# EAGLE design red2 (EAGLE 6.5.0)
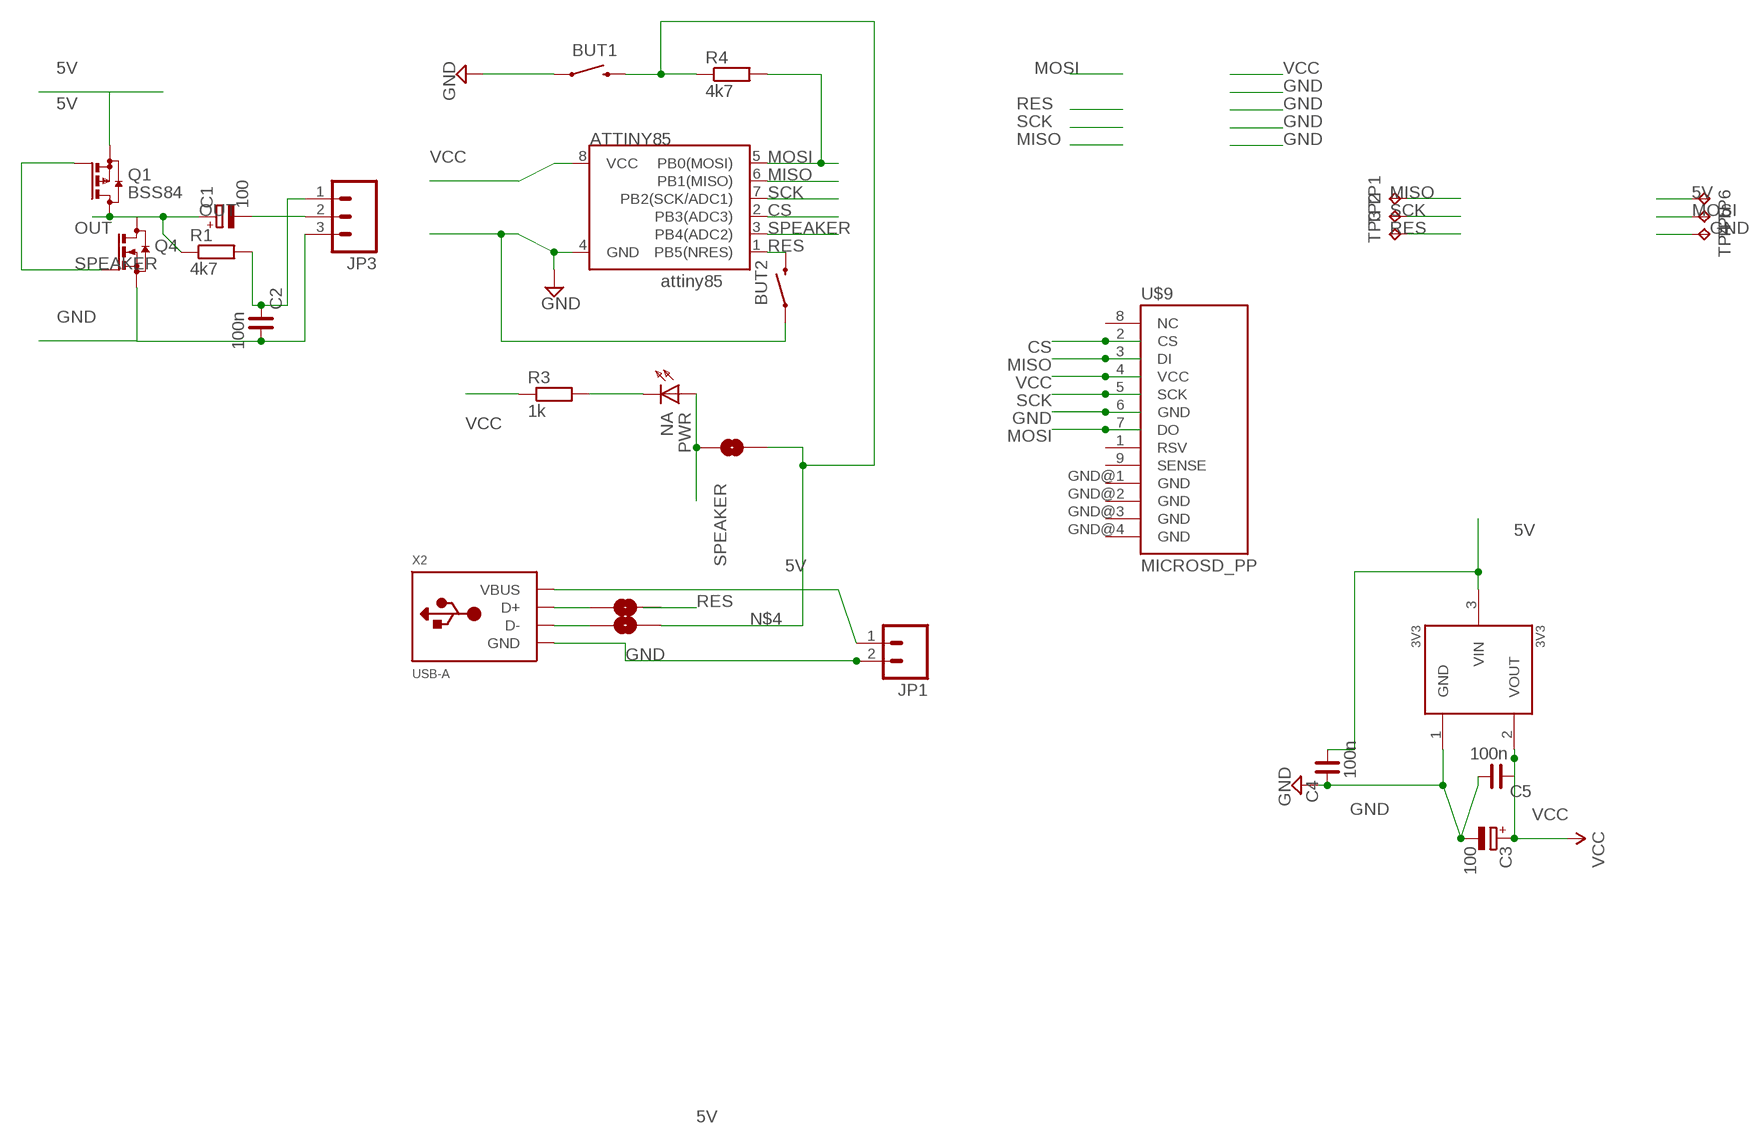
[diagram p0: schematic, sheet 1]

## Parts
3V3  3V3  MCP1700T  [SOT23]
ATTINY85  ATTINY45  [SO08-EIAJ]
BUT1  SWITCH-MOMENTARY-2-SMD-1101NE  [TACTILE-SWITCH-1101NE]
BUT2  SWITCH-MOMENTARY-2-SMD-1101NE  [TACTILE-SWITCH-1101NE]
C1  100  CPOL-EU153CLV-0605  [153CLV-0605]
C2  100n  C_0603  [C0603]
C3  100  CPOL-EU153CLV-0605  [153CLV-0605]
C4  100n  C_0603  [C0603]
C5  100n  C_0603  [C0603]
JP1  M02PTH  [1X02]
JP3  M03PTH  [1X03]
PWR  NA  LED0603DWS  [LED-0603]
Q1  BSS84  [SOT23]
Q4  BSS123  [SOT23]
R1  4k7  R-EU_R0603  [R0603]
R3  1k  R-EU_R0603  [R0603]
R4  4k7  R-EU_R0603  [R0603]
SJ1  SOLDERJUMPERNC  [SJ_2S]
SJ2  SOLDERJUMPERNC  [SJ_2S]
SJ3  SOLDERJUMPERNC  [SJ_2S]
TP1  TPB1,27  [B1,27]
TP2  TPB1,27  [B1,27]
TP3  TPB1,27  [B1,27]
TP4  TPB1,27  [B1,27]
TP5  TPB1,27  [B1,27]
TP6  TPB1,27  [B1,27]
U$9  MICROSD_PP  [MICROSD_PP]
X2  USB-A  [MOLEX_480371000]

## Nets
5V [GND]: 3V3.3(VIN) C4.1 JP1.1 Q1.2(S) TP6.TP X2.1(VBUS)
CS: ATTINY85.2(PB3(ADC3)) U$9.2(CS)
GND: 3V3.1(GND) ATTINY85.4(GND) BUT1.P$1 BUT2.P$1 C2.1 C3.- C4.2 C5.1 JP1.2 JP3.3 Q4.2(S) TP4.TP U$9.6(GND) X2.4(GND)
MISO: ATTINY85.6(PB1(MISO)) TP1.TP U$9.3(DI)
MOSI: ATTINY85.5(PB0(MOSI)) R4.2 TP5.TP U$9.7(DO)
N$1: PWR.C R3.2
N$2: C1.- JP3.2
N$3: SJ3.1 X2.2(D-)
N$4: BUT1.P$2 R4.1 SJ1.2 SJ3.2
N$5: SJ2.1 X2.3(D+)
N$6: C2.2 JP3.1 R1.2
OUT: C1.+ Q1.3(D) Q4.3(D) R1.1
RES: ATTINY85.1(PB5(NRES)) BUT2.P$2 TP3.TP
SCK: ATTINY85.7(PB2(SCK/ADC1)) TP2.TP U$9.5(SCK)
SPEAKER: ATTINY85.3(PB4(ADC2)) PWR.A Q1.1(G) Q4.1(G) SJ1.1
VCC: 3V3.2(VOUT) ATTINY85.8(VCC) C3.+ C5.2 R3.1 U$9.4(VCC)
Unconnected: SJ2.2 U$9.1(RSV) U$9.8(NC) U$9.9(SENSE) U$9.GND@1(GND) U$9.GND@2(GND) U$9.GND@3(GND) U$9.GND@4(GND)

## Notes on the sheet
- attiny85

## Library data of the parts
3V3 = okie:MCP1700T
ATTINY85 = SparkFun:ATTINY45: Atmel ATTiny45
BUT1 BUT2 = SparkFun:SWITCH-MOMENTARY-2
C1 C3 = resistor:CPOL-EU: POLARIZED CAPACITOR, European symbol
C2 C4 C5 = rc-master-smd:C_: NON-POLARIZED CAP
JP1 = ModernDevice:M02: Header 2 Standard 2-pin 0.1" header. Use with straight break away headers (SKU : PRT-00116), right angle break away headers (PRT-00553), swiss pins (PRT-00743), machine pins (PRT-00117), and female headers (PRT-00115). Molex polarized connector foot print use with SKU : PRT-08233 with associated crimp pins and housings.
JP3 = SparkFun:M03: Header 3 Standard 3-pin 0.1" header. Use with straight break away headers (SKU : PRT-00116), right angle break away headers (PRT-00553), swiss pins (PRT-00743), machine pins (PRT-00117), and female headers (PRT-00115). Molex polarized connector foot print use with SKU : PRT-08232 with associated crimp pins and housings.
PWR = DOUBLE-SIDE:LED
Q1 = transistor-small-signal:BSS84: P-CHANNEL MOS FET
Q4 = transistor-small-signal:BSS123: N-CHANNEL MOS FET
R1 R3 R4 = resistor:R-EU_: RESISTOR, European symbol
SJ1-SJ3 = ModernDevice:SOLDERJUMPER: Solder Jumper Standard SMD solder jumper. Used to automate production. Two varients : Normally Open and Normally Closed are the same, but have different paste layers. NC will have a large amount of paste and should jumper during reflow.
TP1-TP6 = testpad:TP: Test pad
U$9 = DE1594-v2:MICROSD_PP
X2 = adafruit:USB-A: USB type A 'plug' Used for things that can directly connect to a USB port, say USB key

## Net classes
0 default: width 0.254 mm, drill 0.381 mm, clearance 0.254 mm
1 GND: width 0.254 mm, drill 0.381 mm, clearance 0.254 mm
2 pwr: width 0.254 mm, drill 0.381 mm, clearance 0.254 mm

## Board
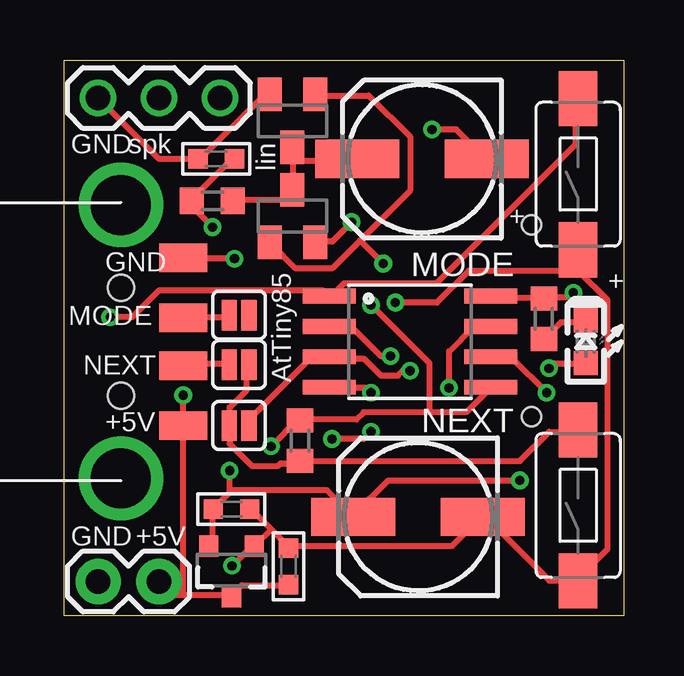
[diagram p1: board, top side]
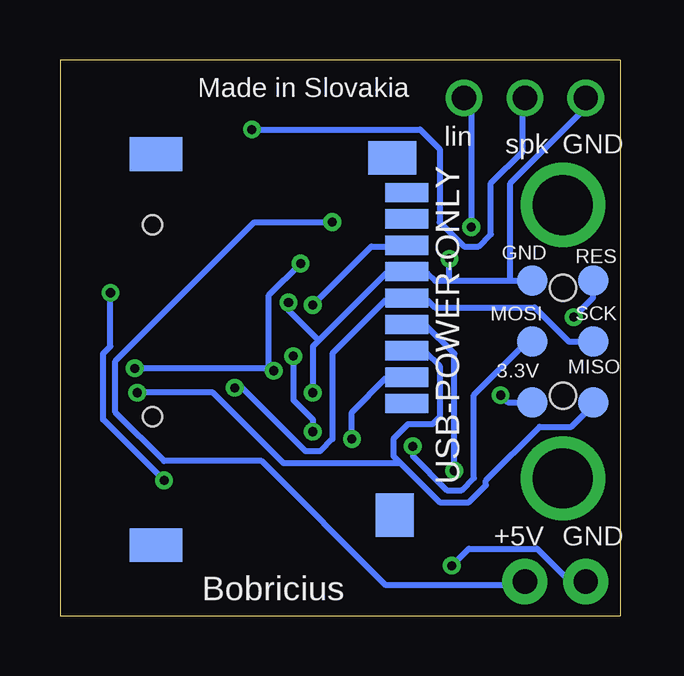
[diagram p2: board, bottom side, seen from below]

Size 23.34 x 23.18 mm. Coordinates in mm from the lower left corner, seen from the top.
Outline: 0,23.18 23.34,23.18 23.34,0 0,0 0,23.18
Copper layers (1*16): Top 0.0356mm / dielectric 1.5011mm / Bottom 0.0356mm
Design rules "LaenPCBOrder (1) *": minimum track width 6mil, minimum drill 13mil, track to track 8mil, track to pad 8mil, pad to pad 8mil, via to via 8mil, smd to smd 6mil, copper to edge 15mil, drill to drill 6mil, minimum pad ring 7mil, minimum via ring 7mil, stop-mask expansion 4mil, vias tented up to drill 30mil, thermal gap 10mil

### Footprints (pad centres in the part's own frame; a part is rotated, then mirrored left to right if it is on the bottom)
SOT23 = smd 0.8 x 0.9: 1 -0.95,-1; 2 0.95,-1; 3 0,1.1
SO08-EIAJ = smd 0.61 x 2.21: 1 -1.905,-3.378; 2 -0.635,-3.378; 3 0.635,-3.378; 4 1.905,-3.378; 5 1.905,3.353; 6 0.635,3.353; 7 -0.635,3.353; 8 -1.905,3.353
TACTILE-SWITCH-1101NE = smd 2.3 x 1.6: P$1 -3.15,0; P$2 3.15,0
153CLV-0605 = smd 3.5 x 1.6: + 2.7,0; - -2.7,0
C0603 = smd 0.8 x 0.8: 1 -0.762,0; 2 0.762,0
1X02 = drill 1.016 pad 1.88: 1 0,0; 2 2.54,0
1X03 = drill 1.016: 1 0,0; 2 2.54,0; 3 5.08,0
LED-0603 = smd 1.016 x 1.016: A 0.889,0; C -0.889,0
SOT23' = smd 1 x 1.4: 1 -0.95,-1.1; 2 0.95,-1.1; 3 0,1.1
R0603 = smd 1 x 1.1: 1 -0.85,0; 2 0.85,0
SJ_2S = smd 0.635 x 1.27: 1 -0.412,0; 2 0.412,0
B1,27 = smd 1.27 x 1.27: TP 0,0
MICROSD_PP = smd 1.8 x 0.8: 1 0,3.85; 2 0,2.75; 3 0,1.65; 4 0,0.55; 5 0,-0.55; 6 0,-1.65; 7 0,-2.75; 8 0,-3.85; 9 0,-4.95 | smd 1.6 x 1.8: GND@1 0.5,8.5 | smd 2.2 x 1.4: GND@2 10.45,9.75; GND@4 10.45,-6.55 | smd 2 x 1.4: GND@3 0.6,-6.4 | hole 0.8: 10.6,4.4; 10.6,-3.6
MOLEX_480371000 = smd 1.2 x 2: 1 3.5,2.6; 2 1,2.6; 3 -1,2.6; 4 -3.5,2.6 | drill 2.5: M1 -5.7,0; M2 5.7,0 | hole 1.1: -2.25,0; 2.25,0

### Placement (x,y rotation side)
3V3  6.98,1.9 180 top
ATTINY85  14.45,11.43 270 top
BUT1  21.43,4.6 90 top
BUT2  21.43,18.41 90 top
C1  14.92,19.05 180 top
C2  6.35,19.05 0 top
C3  14.76,4.13 180 top
C4  9.37,2.06 90 top
C5  6.98,4.45 180 top
JP1  3.97,1.43 180 top
JP3  6.51,21.59 180 top
PWR  21.75,11.43 270 top
Q1  BSS84  [SOT23']  9.53,16.67 0 top
Q4  BSS123  [SOT23']  9.53,20.64 180 top
R1  6.19,17.3 180 top
R3  20,12.38 270 top
R4  9.84,7.3 90 top
SJ1  7.3,7.94 180 top
SJ2  7.3,12.54 0 top
SJ3  7.3,10.48 0 top
TP1  1.11,8.89 0 bottom
TP2  1.11,11.43 0 bottom
TP3  1.11,13.97 0 bottom
TP4  3.65,13.97 0 bottom
TP5  3.65,11.43 0 bottom
TP6  3.65,8.89 0 bottom
U$9  8.89,12.7 180 bottom
X2  2.38,11.43 270 top

### Tracks (layer width: path | path; a pad name or v marks a point on that pad's centre or on a via)
5V  (via drill 0.38)
  Top 0.254: v4.98,9.2 4.98,7.98 X2.1 4.98,7.88 4.98,0.87 | C4.1 9.35,1.28 7.42,1.28 7.01,0.87 3V3.3 6.91,0.87 4.98,0.87 | v11.99,16.41 11.18,15.6 10.57,15.6 Q1.2 | 4.98,0.87 4.57,0.87 4.06,1.38 JP1.1
  Bottom 0.254: v4.98,9.2 4.67,8.9 TP6.TP | v11.99,16.41 15.24,16.41 21.03,10.62 21.03,8.49 19,6.46 14.94,6.46 9.75,1.28 4.17,1.28 4.06,1.38 JP1.1
CS  (via drill 0.38)
  Top 0.254: v11.18,7.37 12.5,7.37 v12.8,7.68 | v13.61,10.83 13.21,10.83 11.99,12.05 11.07,12.05 ATTINY85.2
  Bottom 0.254: v11.18,7.37 11.18,8.49 9.75,9.91 8.94,9.91 U$9.2 | v12.8,7.68 12.8,8.18 13.61,9 v13.61,10.83
GND  (via drill 0.38)
  Top 0.254: JP3.3 3.96,19.06 C2.1 5.69,19.06 8.33,21.7 8.53,21.7 Q4.2 | v7.11,14.89 5.08,14.89 X2.4 | v12.8,9.3 12.6,9.51 11.07,9.51 ATTINY85.4 | 8.64,3.61 9.35,2.9 C4.2 9.45,2.9 16.15,2.9 17.37,4.12 C3.- 17.58,4.12 20.22,1.48 21.34,1.48 BUT1.P$1 21.44,1.58 22.66,2.8 22.66,13.16 21.44,14.38 21.44,15.2 BUT2.P$1 21.34,14.38 16.87,14.38 15.55,13.06 v13.82,13.06 | 8.64,3.61 7.82,4.43 C5.1 | 8.64,3.61 8.03,3 3V3.1 7.82,2.9 v7.01,2.09
  Bottom 0.254: 7.11,13.98 7.72,13.98 8.03,14.28 8.84,14.28 U$9.6 8.94,14.28 9.75,14.28 12.55,11.49 | 7.11,13.98 4.57,13.98 | 4.57,13.98 TP4.TP | 7.11,13.98 v7.11,14.89 | v12.8,9.3 12.8,11.23 12.55,11.49 | 4.57,13.98 4.57,18.04 1.52,21.09 1.52,21.49 JP3.3 | v7.01,2.09 6.3,2.8 3.45,2.8 2.13,1.48 1.52,1.48 JP1.2 | 12.55,11.49 13.82,12.76 v13.82,13.06
MISO  (via drill 0.38)
  Top 0.254: v20.12,9.3 18.69,10.72 17.88,10.72 ATTINY85.6
  Bottom 0.254: 9.2,6.41 9.45,6.66 9.45,7.37 8.84,7.98 7.82,7.98 7.52,8.29 7.52,10.42 8.13,11.03 8.84,11.03 U$9.3 | 9.2,6.41 7.52,4.73 6.3,4.73 5.59,5.44 5.59,5.64 3.35,7.88 2.03,7.88 1.12,8.79 TP1.TP | v20.12,9.3 16.97,9.3 14.02,6.36 9.25,6.36 9.2,6.41
MOSI  (via drill 0.38)
  Top 0.254: 15.24,8.49 16.76,8.49 17.78,9.51 ATTINY85.5 | 15.24,8.49 12.5,8.49 12.19,8.18 9.86,8.18 R4.2 9.75,8.18 v8.64,7.07 | v12.8,12.96 15.24,10.52 15.24,8.49
  Bottom 0.254: v8.64,7.07 8.64,6.66 7.21,5.24 6.6,5.24 6.1,5.75 6.1,9.2 3.96,11.33 3.66,11.33 TP5.TP | v12.8,12.96 10.36,15.4 8.94,15.4 U$9.7
N$1
  Top 0.254: PWR.C 21.74,12.25 20.73,12.25 20.02,11.54 R3.2
N$2  (via drill 0.38)
  Top 0.254: v15.34,20.28 16.36,20.28 17.58,19.06 C1.-
  Bottom 0.254: v15.34,20.28 8.33,20.28 7.52,19.46 7.52,16.41 6.5,15.4 5.89,15.4 5.39,15.91 5.39,18.04 4.06,19.36 4.06,21.49 JP3.2
N$3
  Top 0.254: SJ3.1 6.81,10.52 5.08,10.52 X2.2
N$4
  Top 0.254: SJ3.2 7.62,10.42 7.62,9.4 6.91,8.69 6.91,7.98 SJ1.2 6.91,7.88 6.91,7.17 7.82,6.25 8.94,6.25 9.04,6.36 9.75,6.36 R4.1 9.96,6.46 19,6.46 20.22,7.68 21.34,7.68 BUT1.P$2
N$5
  Top 0.254: SJ2.1 6.81,12.45 5.08,12.45 X2.3
N$6  (via drill 0.38)
  Top 0.254: C2.2 7.11,18.95 6.91,18.95 5.28,17.33 R1.2 5.39,17.23 5.39,17.02 v6.2,16.21
  Bottom 0.254: v6.2,16.21 6.2,21.19 6.5,21.49 JP3.1
OUT
  Top 0.254: R1.1 7.11,17.33 9.04,17.33 9.45,17.74 Q1.3 9.55,17.84 9.55,19.46 Q4.3 9.65,18.95 12.19,18.95 C1.+
RES  (via drill 0.38)
  Top 0.254: v1.93,12.45 2.85,12.45 3.96,13.57 10.77,13.57 10.97,13.37 ATTINY85.1 11.18,13.37 11.68,13.87 15.55,13.87 21.34,19.67 21.34,21.49 BUT2.P$2
  Bottom 0.254: v1.93,12.45 1.12,13.26 1.12,13.87 TP3.TP
SCK  (via drill 0.38)
  Top 0.254: v16.05,9.51 16.05,11.03 17.07,12.05 17.78,12.05 ATTINY85.7
  Bottom 0.254: TP2.TP 2.13,11.44 3.56,12.86 7.72,12.86 8.03,13.16 8.84,13.16 U$9.5 8.94,13.16 9.75,13.16 11.99,10.93 11.99,7.37 12.5,6.86 13.11,6.86 15.75,9.51 v16.05,9.51
SPEAKER  (via drill 0.38)
  Top 0.254: 12.34,15.65 14.43,17.74 14.43,19.97 12.7,21.7 10.57,21.7 Q4.1 | 12.34,15.65 11.18,14.48 9.65,14.48 8.64,15.5 Q1.1 | v20.22,10.32 20.42,10.52 21.74,10.52 PWR.A | v14.43,10.22 14.12,10.22 13.92,10.01 13.21,10.01 12.5,10.72 11.07,10.72 ATTINY85.3 10.97,10.72 10.26,10.72 7.72,8.18 7.72,7.98 SJ1.1 | v13.31,14.69 12.34,15.65
  Bottom 0.254: v20.22,10.32 14.53,10.32 v14.43,10.22 14.63,10.42 14.63,13.37 v13.31,14.69
VCC  (via drill 0.38)
  Top 0.254: ATTINY85.8 17.88,13.26 19.91,13.26 R3.1 20.12,13.26 21.03,13.26 v21.23,13.47 | 3V3.2 6.1,3 6.2,3.1 6.2,4.43 C5.2 6.3,4.53 6.96,5.19 | 6.96,5.19 7.01,5.24 10.97,5.24 11.99,4.22 C3.+ 12.09,4.22 13.51,5.64 v19,5.64 | v6.91,6.05 6.91,5.24 6.96,5.19
  Bottom 0.254: v6.91,6.05 6.91,10.93 8.13,12.15 8.84,12.15 U$9.4 | v21.23,13.47 21.23,11.23 21.54,10.93 21.54,8.18 v19,5.64

### Text on the board
tNames: GND | spk | lin | + | MODE | GND | AtTiny85 | + | MODE | NEXT | NEXT | +5V | GND | +5V
bNames: Made in Slovakia | GND | spk | lin | USB-POWER-ONLY | GND | RES | SCK | MOSI | 3.3V | MISO | GND | +5V | Bobricius